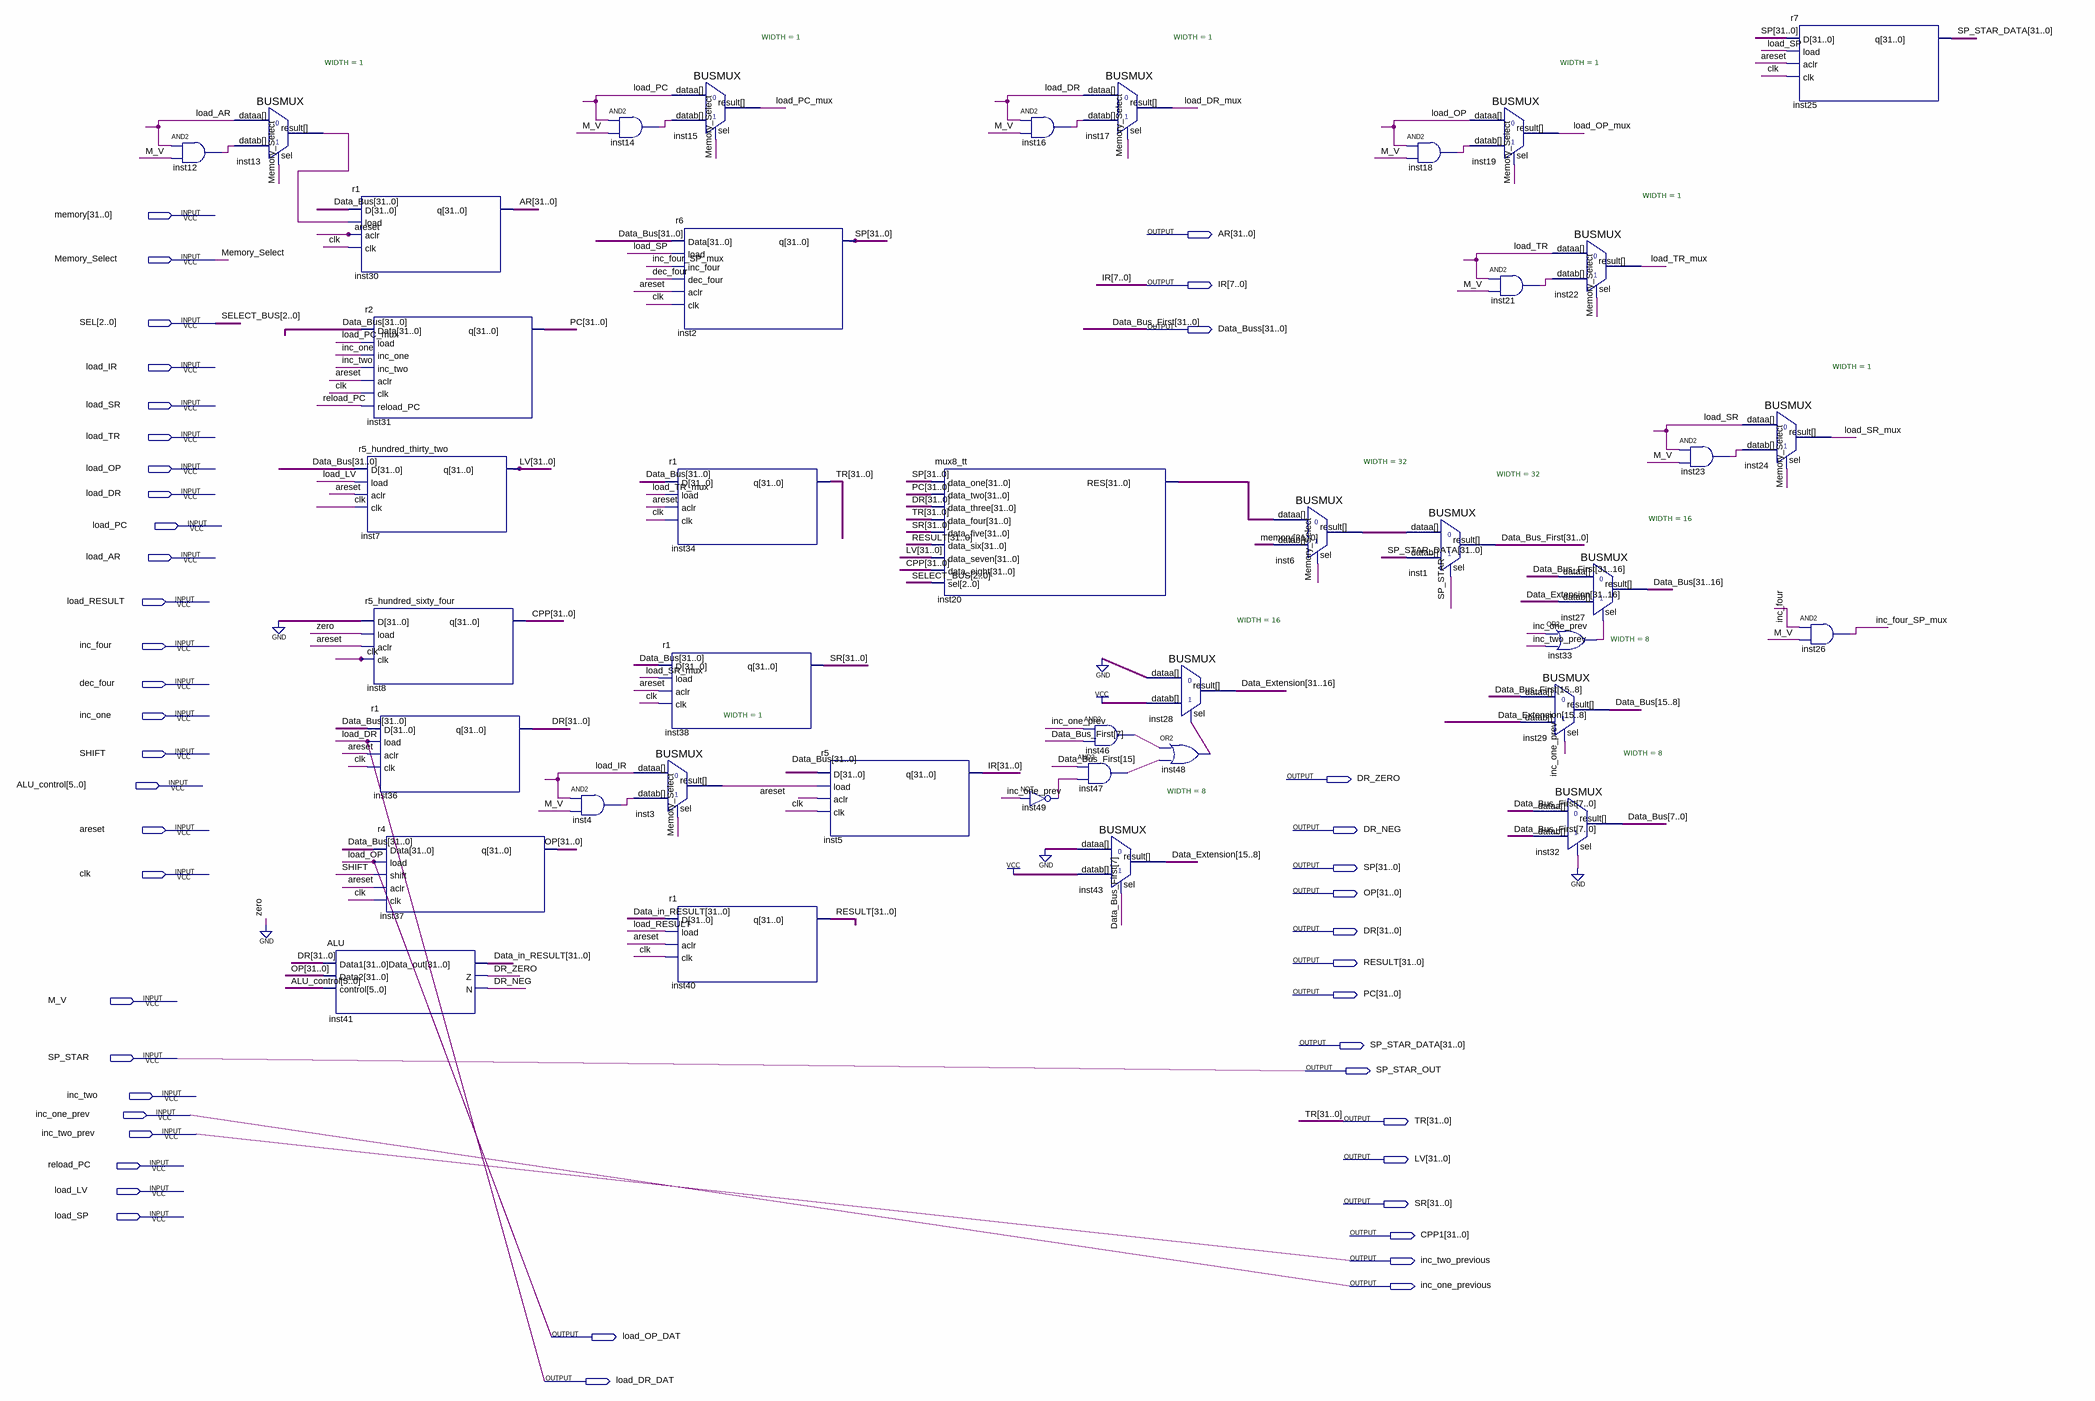
[diagram p0: schematic sheet]
// Quartus schematic data_path.bdf as structural Verilog: 41 symbols, 46 pins
module data_path (
  input  [31:0] memory,
  input  Memory_Select,
  input  [2:0] SEL,
  input  load_IR,
  input  load_SR,
  input  load_TR,
  input  load_OP,
  input  load_DR,
  input  load_PC,
  input  load_AR,
  input  load_RESULT,
  input  inc_four,
  input  dec_four,
  input  inc_one,
  input  SHIFT,
  input  [5:0] ALU_control,
  input  areset,
  input  clk,
  input  M_V,
  input  SP_STAR,
  input  inc_two,
  input  inc_one_prev,
  input  inc_two_prev,
  input  reload_PC,
  input  load_LV,
  input  load_SP,
  output [31:0] AR,
  output [31:0] IR,
  output [31:0] Data_Buss,
  output DR_ZERO,
  output DR_NEG,
  output [31:0] SP,
  output [31:0] OP,
  output [31:0] DR,
  output [31:0] RESULT,
  output [31:0] PC,
  output [31:0] SP_STAR_DATA,
  output SP_STAR_OUT,
  output [31:0] TR,
  output [31:0] LV,
  output [31:0] SR,
  output [31:0] CPP1,
  output inc_two_previous,
  output inc_one_previous,
  output load_OP_DAT,
  output load_DR_DAT
);

  wire inc_four_SP_mux, inst3_result, inst4_out, inst12_out, inst13_result, inst14_out, inst16_out,
       inst18_out, inst21_out, inst23_out, inst33_out, inst46_out, inst47_out, inst48_out, inst49_out,
       load_DR_mux, load_OP_mux, load_PC_mux, load_SR_mux, load_TR_mux;
  wire [31:0] CPP, Data_Bus, Data_in_RESULT, inst6_result, inst20_res;
  wire [31:8] Data_Extension;

  and inst12 (inst12_out, load_AR, M_V);
  BUSMUX #(.WIDTH(1)) inst13 (.datab(inst12_out), .sel(Memory_Select), .dataa(load_AR), .result(inst13_result));
  ALU inst41 (.Data1(DR), .Data2(OP), .control(ALU_control), .Data_out(Data_in_RESULT), .Z(DR_ZERO), .N(DR_NEG));
  r1 inst30 (.D(Data_Bus), .load(inst13_result), .aclr(areset), .clk(clk), .q(AR));
  r2 inst31 (
    .Data(Data_Bus), .load(load_PC_mux), .inc_one(inc_one), .inc_two(inc_two), .aclr(areset), .clk(clk),
    .reload_PC(reload_PC), .q(PC));
  r5_hundred_thirty_two inst7 (.D(Data_Bus), .load(load_LV), .aclr(areset), .clk(clk), .q(LV));
  r5_hundred_sixty_four inst8 (.D({32{1'b0}}), .load(1'b0), .aclr(areset), .clk(clk), .q(CPP));
  r1 inst36 (.D(Data_Bus), .load(load_DR), .aclr(areset), .clk(clk), .q(DR));
  r4 inst37 (.Data(Data_Bus), .load(load_OP), .shift(SHIFT), .aclr(areset), .clk(clk), .q(OP));
  and inst4 (inst4_out, load_IR, M_V);
  and inst14 (inst14_out, load_PC, M_V);
  BUSMUX #(.WIDTH(1)) inst3 (.datab(inst4_out), .sel(Memory_Select), .dataa(load_IR), .result(inst3_result));
  BUSMUX #(.WIDTH(1)) inst15 (.datab(inst14_out), .sel(Memory_Select), .dataa(load_PC), .result(load_PC_mux));
  r6 inst2 (
    .Data(Data_Bus), .load(load_SP), .inc_four(inc_four_SP_mux), .dec_four(dec_four), .aclr(areset),
    .clk(clk), .q(SP));
  r1 inst34 (.D(Data_Bus), .load(load_TR_mux), .aclr(areset), .clk(clk), .q(TR));
  r1 inst38 (.D(Data_Bus), .load(load_SR_mux), .aclr(areset), .clk(clk), .q(SR));
  r1 inst40 (.D(Data_in_RESULT), .load(load_RESULT), .aclr(areset), .clk(clk), .q(RESULT));
  r5 inst5 (.D(Data_Bus), .load(inst3_result), .aclr(areset), .clk(clk), .q(IR));
  mux8_tt inst20 (
    .data_one(SP), .data_two(PC), .data_three(DR), .data_four(TR), .data_five(SR), .data_six(RESULT),
    .data_seven(LV), .data_eight(CPP), .sel(SEL), .RES(inst20_res));
  and inst16 (inst16_out, load_DR, M_V);
  not inst49 (inst49_out, inc_one_prev);
  BUSMUX #(.WIDTH(1)) inst17 (.datab(inst16_out), .sel(Memory_Select), .dataa(load_DR), .result(load_DR_mux));
  and inst46 (inst46_out, inc_one_prev, Data_Buss[7]);
  and inst47 (inst47_out, Data_Buss[15], inst49_out);
  BUSMUX #(.WIDTH(8)) inst43 (.datab({8{1'b1}}), .sel(Data_Buss[7]), .dataa({8{1'b0}}), .result(Data_Extension[15:8]));
  BUSMUX #(.WIDTH(16)) inst28 (
    .datab({16{1'b1}}), .sel(inst48_out), .dataa({16{1'b0}}), .result(Data_Extension[31:16]));
  or inst48 (inst48_out, inst46_out, inst47_out);
  BUSMUX #(.WIDTH(32)) inst6 (.datab(memory), .sel(Memory_Select), .dataa(inst20_res), .result(inst6_result));
  and inst18 (inst18_out, load_OP, M_V);
  BUSMUX #(.WIDTH(32)) inst1 (.datab(SP_STAR_DATA), .sel(SP_STAR), .dataa(inst6_result), .result(Data_Buss));
  BUSMUX #(.WIDTH(1)) inst19 (.datab(inst18_out), .sel(Memory_Select), .dataa(load_OP), .result(load_OP_mux));
  and inst21 (inst21_out, load_TR, M_V);
  BUSMUX #(.WIDTH(1)) inst22 (.datab(inst21_out), .sel(Memory_Select), .dataa(load_TR), .result(load_TR_mux));
  or inst33 (inst33_out, inc_one_prev, inc_two_prev);
  BUSMUX #(.WIDTH(8)) inst29 (
    .datab(Data_Extension[15:8]), .sel(inc_one_prev), .dataa(Data_Buss[15:8]), .result(Data_Bus[15:8]));
  BUSMUX #(.WIDTH(8)) inst32 (.datab(Data_Buss[7:0]), .sel(1'b0), .dataa(Data_Buss[7:0]), .result(Data_Bus[7:0]));
  BUSMUX #(.WIDTH(16)) inst27 (
    .datab(Data_Extension[31:16]), .sel(inst33_out), .dataa(Data_Buss[31:16]), .result(Data_Bus[31:16]));
  and inst23 (inst23_out, load_SR, M_V);
  BUSMUX #(.WIDTH(1)) inst24 (.datab(inst23_out), .sel(Memory_Select), .dataa(load_SR), .result(load_SR_mux));
  r7 inst25 (.D(SP), .load(load_SP), .aclr(areset), .clk(clk), .q(SP_STAR_DATA));
  and inst26 (inc_four_SP_mux, inc_four, M_V);

  assign inc_one_previous = inc_one_prev;
  assign inc_two_previous = inc_two_prev;
  assign load_DR_DAT = load_DR;
  assign load_OP_DAT = load_OP;
  assign SP_STAR_OUT = SP_STAR;

  // Other names for the same wires on the sheet: Data_Bus_First[31:0] = Data_Buss; SELECT_BUS[2:0] = SEL
endmodule
